# Altium schematic sheet Current_Sens.SchDoc
size 259 x 167 mm; SheetNumber: 14; SheetTotal: 15
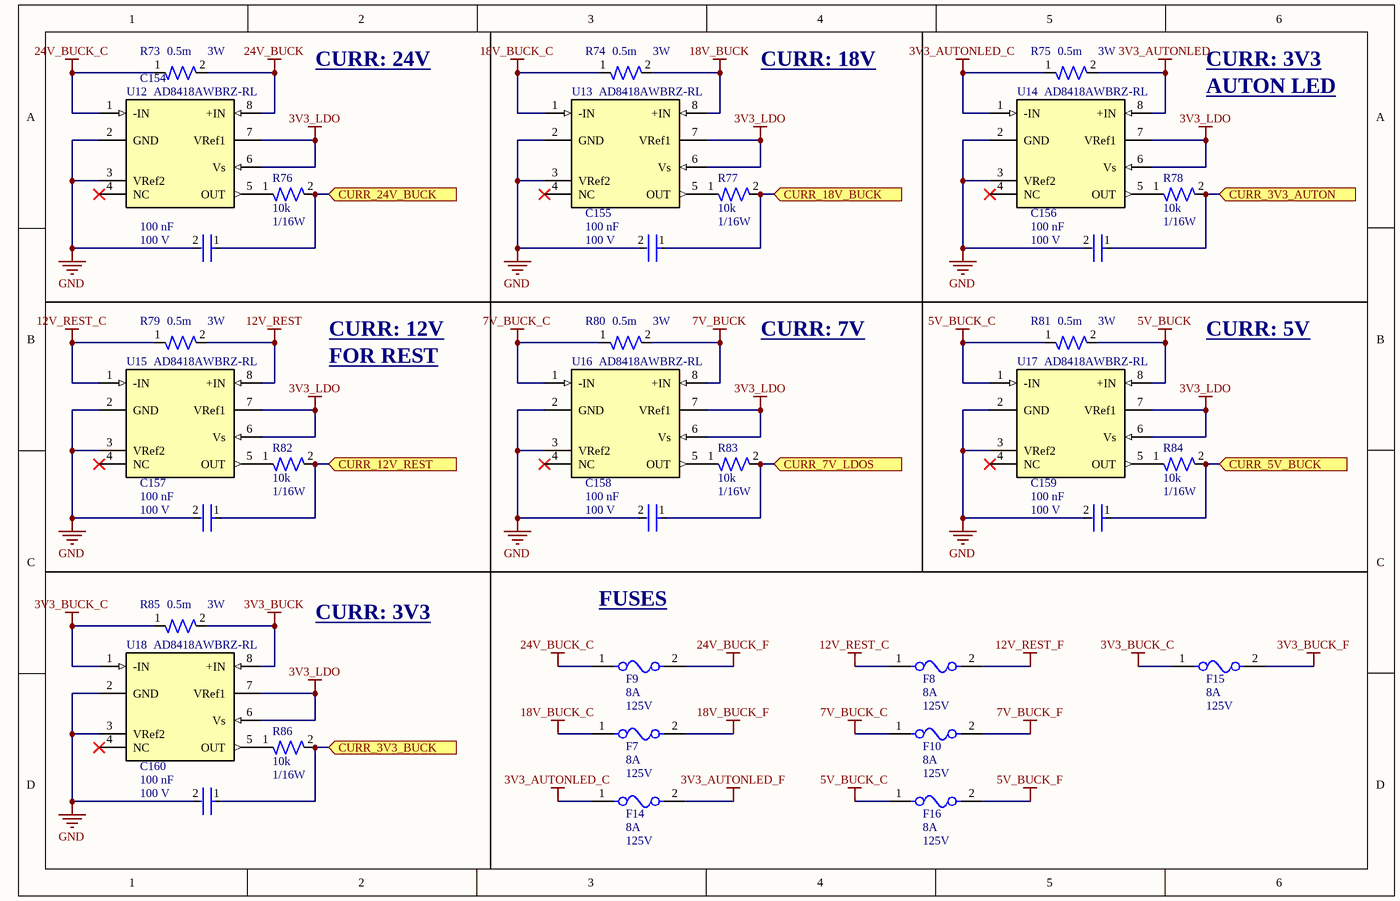
[diagram p0: Current_Sens.SchDoc]

## Parts
C154  Capacitance: 100 nF  Voltage: 100 V  [CAP-0603]  (hidden comment: CC0603KRX7R0BB104)
C155  Capacitance: 100 nF  Voltage: 100 V  [CAP-0603]  (hidden comment: CC0603KRX7R0BB104)
C156  Capacitance: 100 nF  Voltage: 100 V  [CAP-0603]  (hidden comment: CC0603KRX7R0BB104)
C157  Capacitance: 100 nF  Voltage: 100 V  [CAP-0603]  (hidden comment: CC0603KRX7R0BB104)
C158  Capacitance: 100 nF  Voltage: 100 V  [CAP-0603]  (hidden comment: CC0603KRX7R0BB104)
C159  Capacitance: 100 nF  Voltage: 100 V  [CAP-0603]  (hidden comment: CC0603KRX7R0BB104)
C160  Capacitance: 100 nF  Voltage: 100 V  [CAP-0603]  (hidden comment: CC0603KRX7R0BB104)
F7  Fuse Current: 8A  Voltage Rating: 125V  [FUSE-0001]  (hidden comment: 01550900M)
F8  Fuse Current: 8A  Voltage Rating: 125V  [FUSE-0001]  (hidden comment: 01550900M)
F9  Fuse Current: 8A  Voltage Rating: 125V  [FUSE-0001]  (hidden comment: 01550900M)
F10  Fuse Current: 8A  Voltage Rating: 125V  [FUSE-0001]  (hidden comment: 01550900M)
F14  Fuse Current: 8A  Voltage Rating: 125V  [FUSE-0001]  (hidden comment: 01550900M)
F15  Fuse Current: 8A  Voltage Rating: 125V  [FUSE-0001]  (hidden comment: 01550900M)
F16  Fuse Current: 8A  Voltage Rating: 125V  [FUSE-0001]  (hidden comment: 01550900M)
R73  Power: 3W  Resistance: 0.5m  [RES-2512]  (hidden comment: CSNL2512FTL500)
R74  Power: 3W  Resistance: 0.5m  [RES-2512]  (hidden comment: CSNL2512FTL500)
R75  Power: 3W  Resistance: 0.5m  [RES-2512]  (hidden comment: CSNL2512FTL500)
R76  Resistance: 10k  Power: 1/16W  [RES-0402]  (hidden comment: RC0402FR-0710KL)
R77  Resistance: 10k  Power: 1/16W  [RES-0402]  (hidden comment: RC0402FR-0710KL)
R78  Resistance: 10k  Power: 1/16W  [RES-0402]  (hidden comment: RC0402FR-0710KL)
R79  Power: 3W  Resistance: 0.5m  [RES-2512]  (hidden comment: CSNL2512FTL500)
R80  Power: 3W  Resistance: 0.5m  [RES-2512]  (hidden comment: CSNL2512FTL500)
R81  Power: 3W  Resistance: 0.5m  [RES-2512]  (hidden comment: CSNL2512FTL500)
R82  Resistance: 10k  Power: 1/16W  [RES-0402]  (hidden comment: RC0402FR-0710KL)
R83  Resistance: 10k  Power: 1/16W  [RES-0402]  (hidden comment: RC0402FR-0710KL)
R84  Resistance: 10k  Power: 1/16W  [RES-0402]  (hidden comment: RC0402FR-0710KL)
R85  Power: 3W  Resistance: 0.5m  [RES-2512]  (hidden comment: CSNL2512FTL500)
R86  Resistance: 10k  Power: 1/16W  [RES-0402]  (hidden comment: RC0402FR-0710KL)
U12  AD8418AWBRZ-RL  [IC-CURR]
U13  AD8418AWBRZ-RL  [IC-CURR]
U14  AD8418AWBRZ-RL  [IC-CURR]
U15  AD8418AWBRZ-RL  [IC-CURR]
U16  AD8418AWBRZ-RL  [IC-CURR]
U17  AD8418AWBRZ-RL  [IC-CURR]
U18  AD8418AWBRZ-RL  [IC-CURR]

## Ports
CURR_3V3_AUTON (in), CURR_3V3_BUCK (in, see MCU[4D]), CURR_5V_BUCK (in, see MCU[4D]), CURR_7V_LDOS (in), CURR_12V_REST (in), CURR_18V_BUCK (in, see MCU[4C]), CURR_24V_BUCK (in, see MCU[4C])

## Nets
3V3_AUTONLED: R75.2 U14.8(+IN)
3V3_AUTONLED_C: F14.1 R75.1 U14.1(-IN)
3V3_AUTONLED_F: F14.2
3V3_BUCK: R85.2 U18.8(+IN)
3V3_BUCK_C: F15.1 R85.1 U18.1(-IN)
3V3_BUCK_F: F15.2
3V3_LDO: U12.6(Vs) U12.7(VRef1) U13.6(Vs) U13.7(VRef1) U14.6(Vs) U14.7(VRef1) U15.6(Vs) U15.7(VRef1) U16.6(Vs) U16.7(VRef1) U17.6(Vs) U17.7(VRef1) U18.6(Vs) U18.7(VRef1)
5V_BUCK: R81.2 U17.8(+IN)
5V_BUCK_C: F16.1 R81.1 U17.1(-IN)
5V_BUCK_F: F16.2
7V_BUCK: R80.2 U16.8(+IN)
7V_BUCK_C: F10.1 R80.1 U16.1(-IN)
7V_BUCK_F: F10.2
12V_REST: R79.2 U15.8(+IN)
12V_REST_C: F8.1 R79.1 U15.1(-IN)
12V_REST_F: F8.2
18V_BUCK: R74.2 U13.8(+IN)
18V_BUCK_C: F7.1 R74.1 U13.1(-IN)
18V_BUCK_F: F7.2
24V_BUCK: R73.2 U12.8(+IN)
24V_BUCK_C: F9.1 R73.1 U12.1(-IN)
24V_BUCK_F: F9.2
GND: C154.2 C155.2 C156.2 C157.2 C158.2 C159.2 C160.2 U12.2(GND) U12.3(VRef2) U13.2(GND) U13.3(VRef2) U14.2(GND) U14.3(VRef2) U15.2(GND) U15.3(VRef2) U16.2(GND) U16.3(VRef2) U17.2(GND) U17.3(VRef2) U18.2(GND) U18.3(VRef2)
CURR_3V3_AUTON: C156.1 R78.2 ; port CURR_3V3_AUTON
CURR_3V3_BUCK: C160.1 R86.2 ; port CURR_3V3_BUCK
CURR_5V_BUCK: C159.1 R84.2 ; port CURR_5V_BUCK
CURR_7V_LDOS: C158.1 R83.2 ; port CURR_7V_LDOS
CURR_12V_REST: C157.1 R82.2 ; port CURR_12V_REST
CURR_18V_BUCK: C155.1 R77.2 ; port CURR_18V_BUCK
CURR_24V_BUCK: C154.1 R76.2 ; port CURR_24V_BUCK
NetR76_1: R76.1 U12.5(OUT)
NetR77_1: R77.1 U13.5(OUT)
NetR78_1: R78.1 U14.5(OUT)
NetR82_1: R82.1 U15.5(OUT)
NetR83_1: R83.1 U16.5(OUT)
NetR84_1: R84.1 U17.5(OUT)
NetR86_1: R86.1 U18.5(OUT)

Not connected (* = marked no-connect by the designer): U12 4(NC)*; U13 4(NC)*; U14 4(NC)*; U15 4(NC)*; U16 4(NC)*; U17 4(NC)*; U18 4(NC)*

## Notes on the sheet
- CURR: 24V
- CURR: 18V
- CURR: 3V3
- AUTON LED
- CURR: 12V
- FOR REST
- CURR: 7V
- CURR: 5V
- FUSES

## Library data of the parts
C154-C160 = CAP-100N-0001: CAP CER 0.1UF 100V X7R 0603; Device Class: Ceramic; Size: 0603; ComponentLink1Description: Datasheet; ComponentLink1URL: https://www.yageo.com/upload/media/product/app/datasheet/mlcc/upy-np0x7r_mv_100-to-630v.pdf
F7-F10 F14-F16 = FUSE-0001: FUSE BLOK CARTRIDGE 125V 10A SMD; ComponentLink2Description: Datasheet; ComponentLink2URL: https://www.littelfuse.com/~/media/electronics/datasheets/fuses/littelfuse_fuse_154_154t_154l_154tl_datasheet.pdf.pdf
R73-R75 R79-R81 R85 = RES-0.5m-0001: 2512 Chip Resistor - Surface Mount ROHS; Tolerance: 1%; Size: 0402; ComponentLink1Description: Datasheet; ComponentLink1URL: https://www.yageo.com/upload/media/product/products/datasheet/rchip/PYu-RC_Group_51_RoHS_L_12.pdf
R76-R78 R82-R84 R86 = RES-10k-0001: RES 10K OHM 1% 1/16W 0402; Tolerance: 1%; Size: 0402; ComponentLink1Description: Datasheet; ComponentLink1URL: https://www.yageo.com/upload/media/product/products/datasheet/rchip/PYu-RC_Group_51_RoHS_L_12.pdf
U12-U18 = IC-CURR-0001: Current Sense Amplifier 1 Circuit 8-MSOP